# Altium schematic sheet Mouse Sensor B3.SchDoc
size 353 x 223 mm; SheetNumber: 2
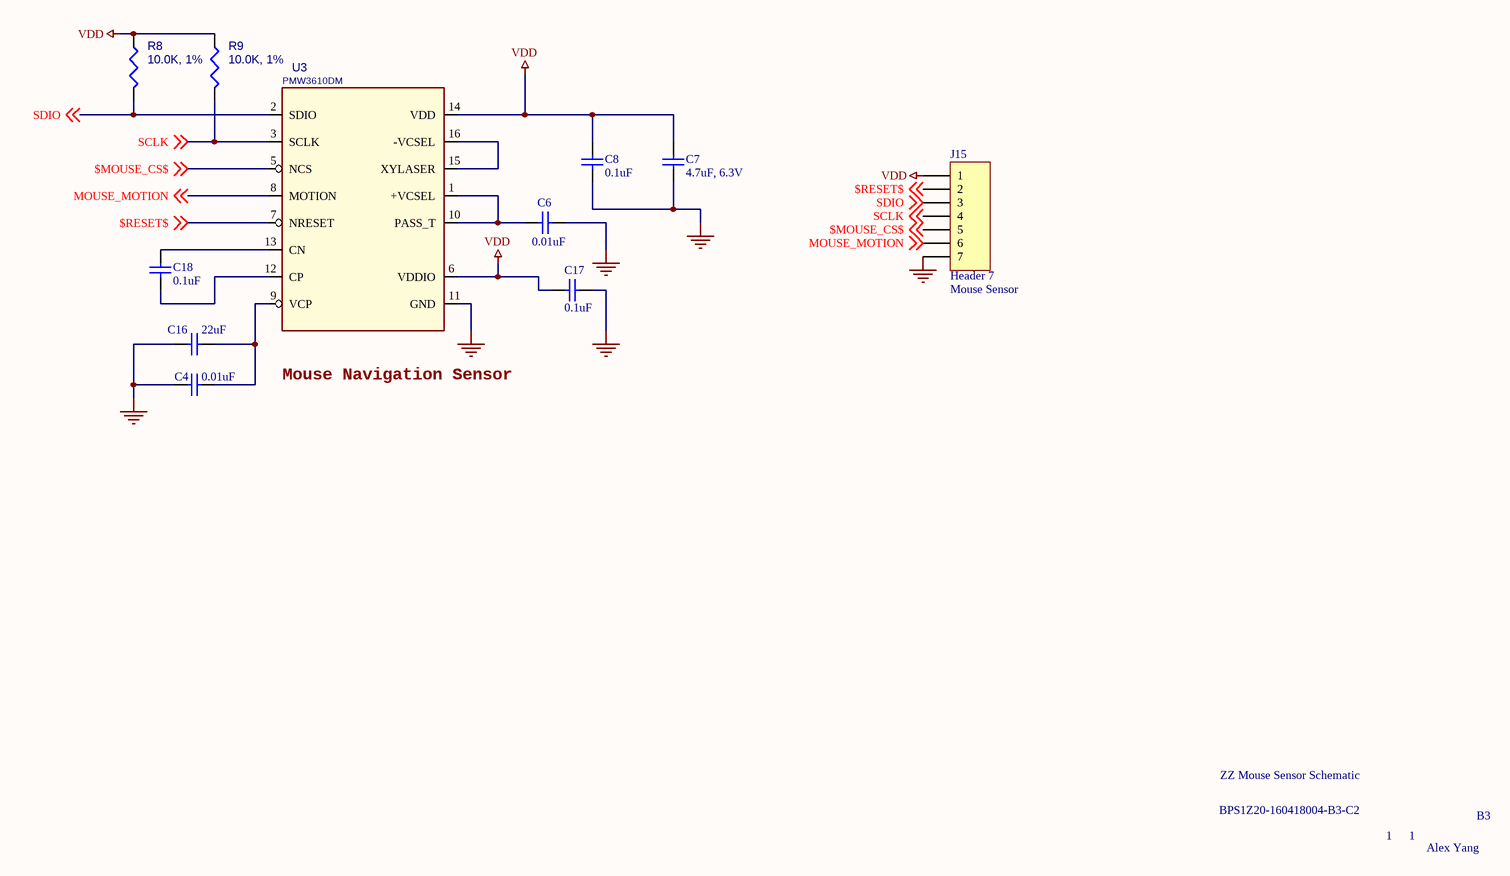
[diagram p0: Mouse Sensor B3.SchDoc]

## Parts
C4  0.01uF  [RAD-0.3]
C6  0.01uF  [RAD-0.3]
C7  4.7uF, 6.3V  [RAD-0.3]
C8  0.1uF  [RAD-0.3]
C16  22uF  [RAD-0.3]
C17  0.1uF  [RAD-0.3]
C18  0.1uF  [RAD-0.3]
J15  Header 7  [HDR1X7h]
R8  10.0K, 1%  [0402]
R9  10.0K, 1%  [0402]
U3  PMW3610DM  [PMW_3610_DIP16]

## Nets
GND: C4.1 C6.2 C7.1 C8.1 C16.1 C17.2 J15.7 U3.11(GND)
VDD: C7.2 C8.2 C17.1 J15.1 R8.1 R9.1 U3.6(VDDIO) U3.14(VDD)
$MOUSE_CS$: J15.5 U3.5(NCS) ; off-sheet $MOUSE_CS$
$RESET$: J15.2 U3.7(NRESET) ; off-sheet $RESET$
MOUSE_MOTION: J15.6 U3.8(MOTION) ; off-sheet MOUSE_MOTION
SCLK: J15.4 R9.2 U3.3(SCLK) ; off-sheet SCLK
SDIO: J15.3 R8.2 U3.2(SDIO) ; off-sheet SDIO
NetC4_2: C4.2 C16.2 U3.9(VCP)
NetC6_1: C6.1 U3.1(+VCSEL) U3.10(PASS_T)
NetC18_1: C18.1 U3.12(CP)
NetC18_2: C18.2 U3.13(CN)
NetU3_15: U3.15(XYLASER) U3.16(-VCSEL)

## Notes on the sheet
- (near J15) Mouse Sensor
- Mouse Navigation Sensor
- BPS1Z20-160418004-B3-C2
- ZZ Mouse Sensor Schematic
- B3
- 1
- Alex Yang

## Library data of the parts
C4 C6-C8 C16-C18 = Cap: Capacitor; Value: 100pF; Published: 8-Jun-2000; LatestRevisionDate: 17-Jul-2002; LatestRevisionNote: Re-released for DXP Platform.; PackageReference: RAD-0.3; Publisher: Altium Limited; PackageDescription: Radial Cap, Thru-Hole; 2 Leads; 0.3 in Pin Spacing
J15 = Header 7: Header, 7-Pin; LatestRevisionDate: 17-Jul-2002; LatestRevisionNote: Re-released for DXP Platform.; Publisher: Altium Limited
R8 R9 = R